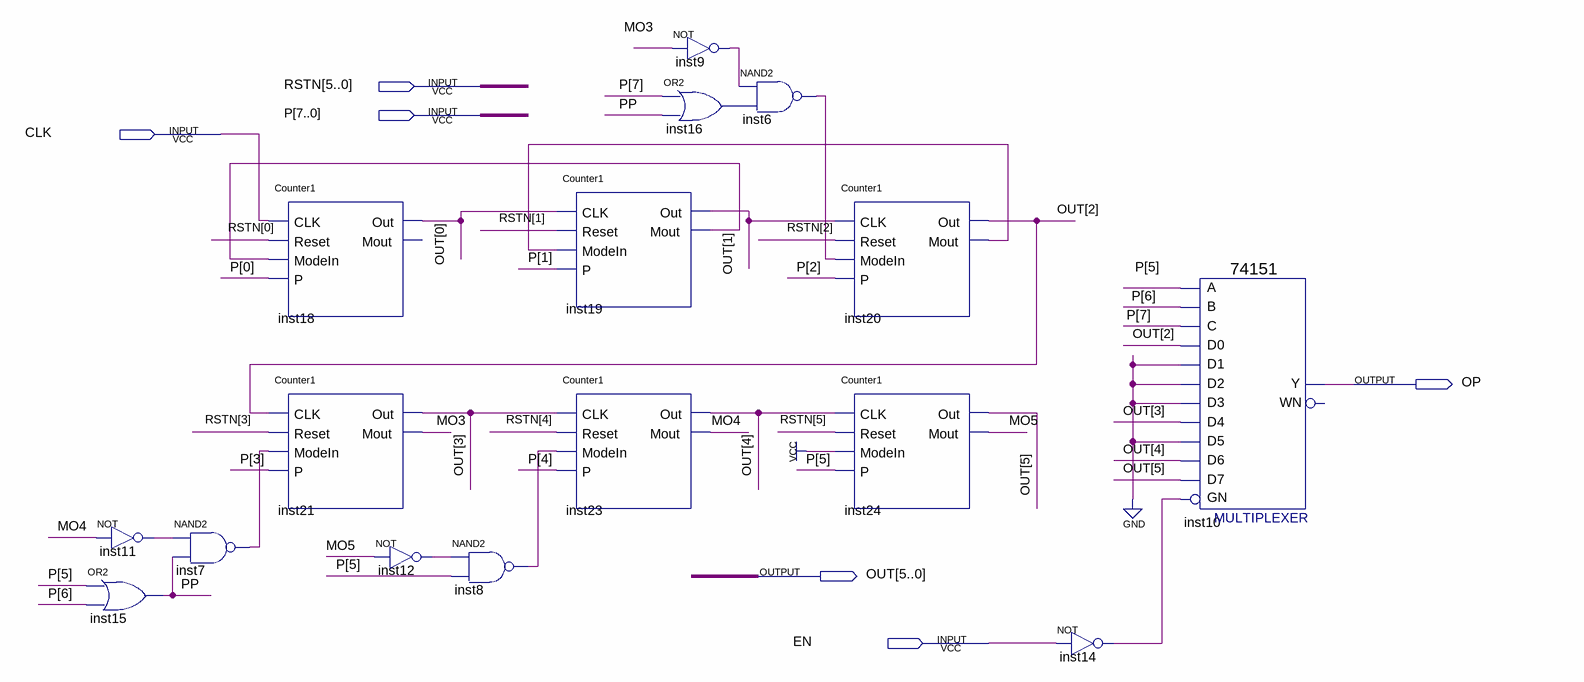
[diagram p0: schematic sheet]
// Quartus schematic Counter2_3Connect.bdf as structural Verilog: 16 symbols, 6 pins
module Counter2_3Connect (
  input  [5:0] RSTN,
  input  [7:0] P,
  input  CLK,
  input  EN,
  output OP,
  output [5:0] OUT
);

  wire inst6_out, inst7_out, inst8_out, inst9_out, inst11_out, inst12_out, inst14_out, inst16_out,
       inst19_mout, inst20_mout, MO3, MO4, MO5, PP;

  not inst11 (inst11_out, MO4);
  or inst15 (PP, P[5], P[6]);
  nand inst7 (inst7_out, inst11_out, PP);
  Counter1 inst18 (.CLK(CLK), .Reset(RSTN[0]), .ModeIn(inst19_mout), .P(P[0]), .Out(OUT[0]));  // open: Mout
  Counter1 inst21 (.CLK(OUT[2]), .Reset(RSTN[3]), .ModeIn(inst7_out), .P(P[3]), .Out(OUT[3]), .Mout(MO3));
  not inst12 (inst12_out, MO5);
  nand inst8 (inst8_out, inst12_out, P[5]);
  Counter1 inst19 (.CLK(OUT[0]), .Reset(RSTN[1]), .ModeIn(inst20_mout), .P(P[1]), .Out(OUT[1]), .Mout(inst19_mout));
  Counter1 inst23 (.CLK(OUT[3]), .Reset(RSTN[4]), .ModeIn(inst8_out), .P(P[4]), .Out(OUT[4]), .Mout(MO4));
  or inst16 (inst16_out, P[7], PP);
  not inst9 (inst9_out, MO3);
  nand inst6 (inst6_out, inst9_out, inst16_out);
  Counter1 inst20 (.CLK(OUT[1]), .Reset(RSTN[2]), .ModeIn(inst6_out), .P(P[2]), .Out(OUT[2]), .Mout(inst20_mout));
  Counter1 inst24 (.CLK(OUT[4]), .Reset(RSTN[5]), .ModeIn(1'b1), .P(P[5]), .Out(OUT[5]), .Mout(MO5));
  not inst14 (inst14_out, EN);
  \74151  inst10 (
    .GN(inst14_out), .C(P[7]), .B(P[6]), .A(P[5]), .D5(1'b0), .D0(OUT[2]), .D1(1'b0), .D4(OUT[3]), .D3(1'b0),
    .D2(1'b0), .D6(OUT[4]), .D7(OUT[5]), .Y(OP));  // open: WN
endmodule
